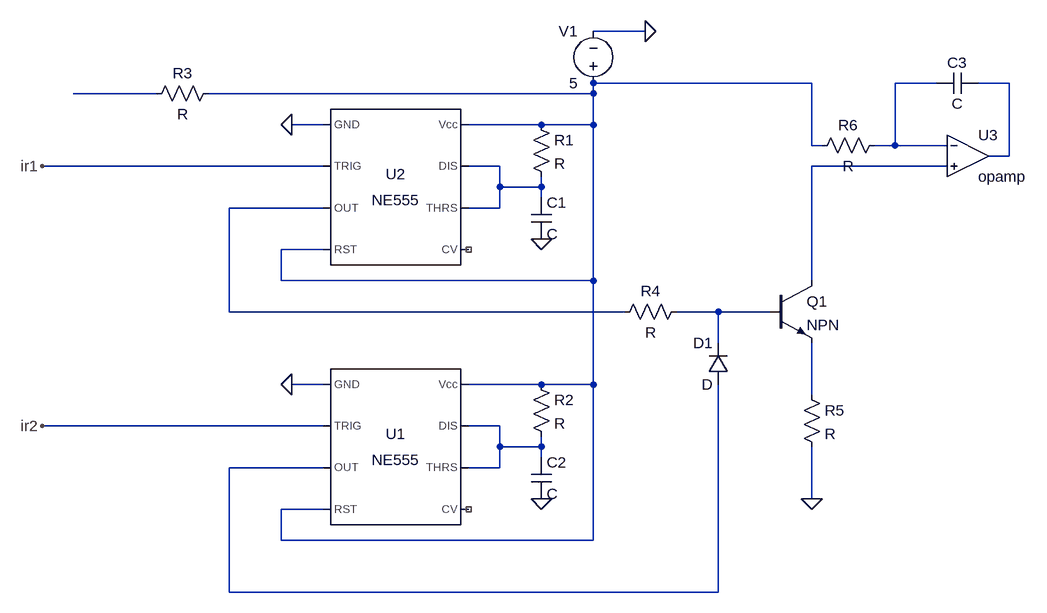
[diagram p0: schematic Draft2.asc]
Draft2.asc, the LTspice schematic file:
Version 4.1
SHEET 1 1044 680
WIRE 480 -464 400 -464
WIRE 736 -384 400 -384
WIRE 928 -384 864 -384
WIRE 1040 -384 992 -384
WIRE -272 -368 -400 -368
WIRE 400 -368 400 -384
WIRE 400 -368 -192 -368
WIRE -16 -320 -64 -320
WIRE 320 -320 208 -320
WIRE 400 -320 400 -368
WIRE 400 -320 320 -320
WIRE 736 -288 736 -384
WIRE 752 -288 736 -288
WIRE 864 -288 864 -384
WIRE 864 -288 832 -288
WIRE 944 -288 864 -288
WIRE 1040 -272 1040 -384
WIRE 1040 -272 1008 -272
WIRE -16 -256 -448 -256
WIRE 256 -256 208 -256
WIRE 944 -256 736 -256
WIRE 256 -224 256 -256
WIRE 320 -224 320 -240
WIRE 320 -224 256 -224
WIRE 320 -208 320 -224
WIRE -16 -192 -160 -192
WIRE 256 -192 256 -224
WIRE 256 -192 208 -192
WIRE -16 -128 -80 -128
WIRE -80 -80 -80 -128
WIRE 400 -80 400 -320
WIRE 400 -80 -80 -80
WIRE 736 -80 736 -256
WIRE -160 -32 -160 -192
WIRE 448 -32 -160 -32
WIRE 592 -32 528 -32
WIRE 672 -32 592 -32
WIRE 592 16 592 -32
WIRE -16 80 -64 80
WIRE 320 80 208 80
WIRE 400 80 400 -80
WIRE 400 80 320 80
WIRE 736 96 736 16
WIRE -16 144 -448 144
WIRE 256 144 208 144
WIRE 256 176 256 144
WIRE 320 176 320 160
WIRE 320 176 256 176
WIRE 320 192 320 176
WIRE -16 208 -160 208
WIRE 256 208 256 176
WIRE 256 208 208 208
WIRE 736 256 736 176
WIRE -16 272 -80 272
WIRE -80 320 -80 272
WIRE 400 320 400 80
WIRE 400 320 -80 320
WIRE -160 400 -160 208
WIRE 592 400 592 80
WIRE 592 400 -160 400
FLAG 480 -464 0
FLAG -448 -256 ir1
FLAG -448 144 ir2
FLAG 320 256 0
FLAG 320 -144 0
FLAG -64 -320 0
FLAG -64 80 0
FLAG 736 256 0
SYMBOL Misc\\NE555 96 176 R0
SYMATTR InstName U1
SYMBOL Misc\\NE555 96 -224 R0
SYMATTR InstName U2
SYMBOL voltage 400 -368 R180
WINDOW 0 24 96 Left 2
WINDOW 3 24 16 Left 2
WINDOW 123 0 0 Left 0
WINDOW 39 0 0 Left 0
SYMATTR InstName V1
SYMATTR Value 5
SYMBOL res 304 -336 R0
SYMATTR InstName R1
SYMBOL res 304 64 R0
SYMATTR InstName R2
SYMBOL res -176 -384 R90
WINDOW 0 0 56 VBottom 2
WINDOW 3 32 56 VTop 2
SYMATTR InstName R3
SYMBOL cap 304 -208 R0
SYMATTR InstName C1
SYMBOL cap 304 192 R0
SYMATTR InstName C2
SYMBOL npn 672 -80 R0
SYMATTR InstName Q1
SYMBOL res 544 -48 R90
WINDOW 0 0 56 VBottom 2
WINDOW 3 32 56 VTop 2
SYMATTR InstName R4
SYMBOL diode 608 80 R180
WINDOW 0 24 64 Left 2
WINDOW 3 24 0 Left 2
SYMATTR InstName D1
SYMBOL res 720 80 R0
SYMATTR InstName R5
SYMBOL OpAmps\\opamp 976 -336 R0
SYMATTR InstName U3
SYMBOL res 848 -304 R90
WINDOW 0 0 56 VBottom 2
WINDOW 3 32 56 VTop 2
SYMATTR InstName R6
SYMBOL cap 992 -400 R90
WINDOW 0 0 32 VBottom 2
WINDOW 3 32 32 VTop 2
SYMATTR InstName C3

The netlist it stands for:
* Draft2.asc
X§U1 0 ir2 N011 N001 NC_01 N010 N010 N001 NE555  ; pins GND TRIG OUT RST CV THRS DIS Vcc
X§U2 0 ir1 N007 N001 NC_02 N005 N005 N001 NE555  ; pins GND TRIG OUT RST CV THRS DIS Vcc
V1 N001 0 5
R1 N001 N005 R
R2 N001 N010 R
R3 N001 N004 R
C1 N005 0 C
C2 N010 0 C
Q1 N006 N008 N009 0 NPN
R4 N008 N007 R
D1 N011 N008 D
R5 N009 0 R
X§U3 N002 N006 N003 opamp Aol=100K GBW=10Meg  ; pins invin noninvin out
R6 N002 N001 R
C3 N003 N002 C
.model D D
.lib standard.dio
.model NPN NPN
.model PNP PNP
.lib standard.bjt
.lib NE555.sub
.backanno
.end